# EAGLE schematic sub-unit-and-psu (EAGLE 9.6.2)
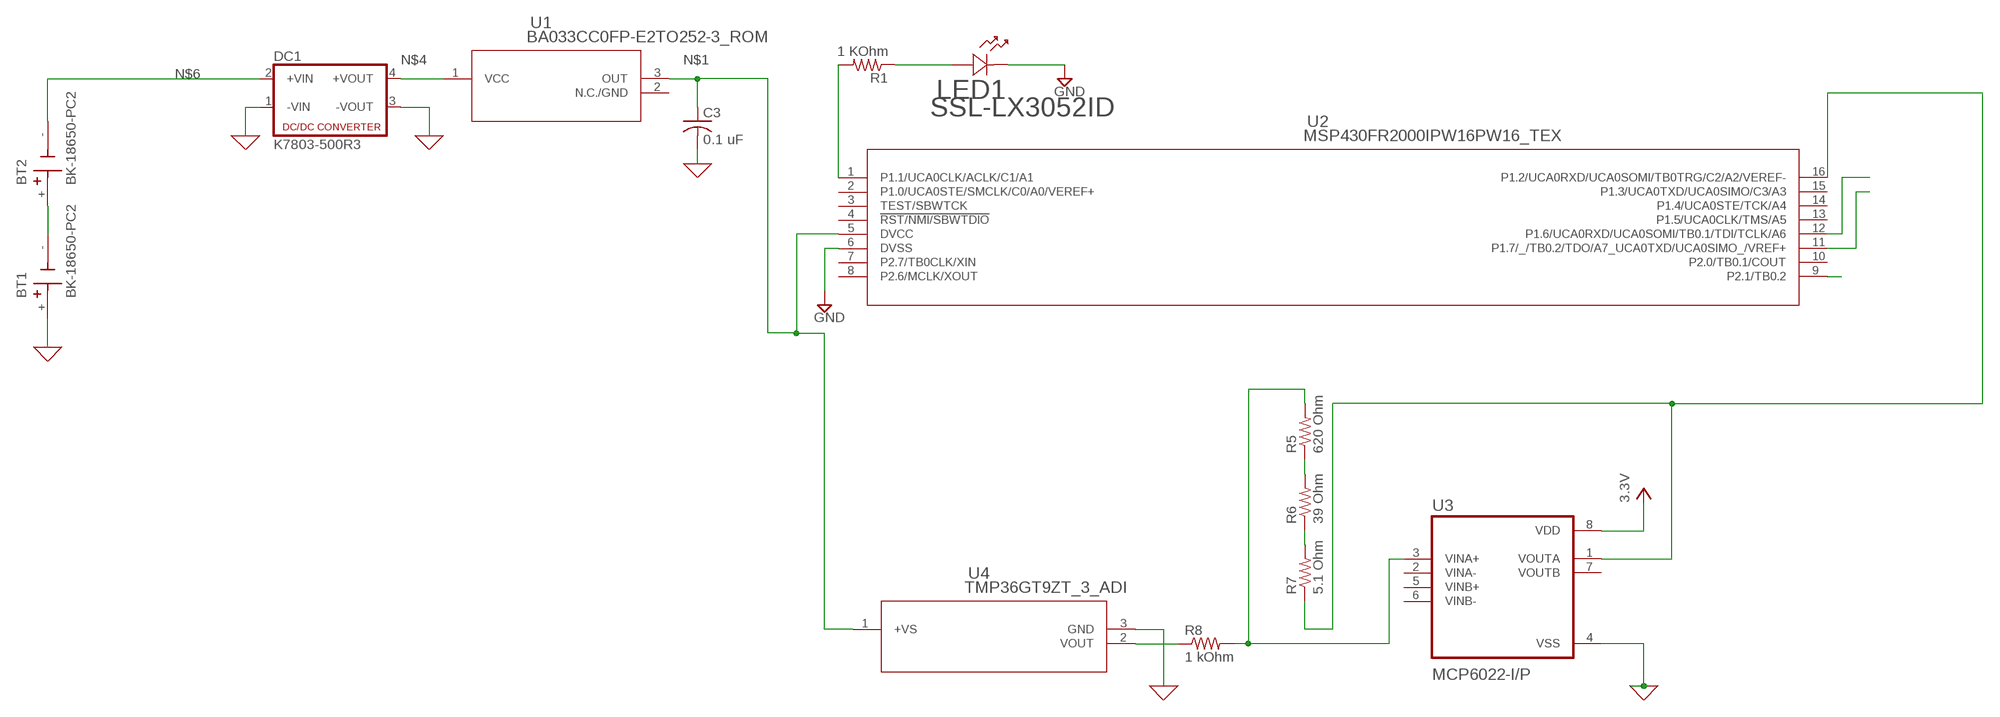
[diagram p0: schematic, sheet 1]

## Parts
BT1  BK-18650-PC2  [BAT_BK-18650-PC2]
BT2  BK-18650-PC2  [BAT_BK-18650-PC2]
C3  0.1 uF  C-US050-024X044  [C050-024X044]
DC1  K7803-500R3  NME  [NME]
LED1  SSL-LX3052ID  [LED_SSL-LX30_T-3_LUM]
R1  1 KOhm  R-US_0204/5  [0204/5]
R5  620 Ohm  R-US_0204/7  [0204/7]
R6  39 Ohm  R-US_0204/7  [0204/7]
R7  5.1 Ohm  R-US_0204/7  [0204/7]
R8  1 kOhm  R-US_0204/7  [0204/7]
U1  BA033CC0FP-E2TO252-3_ROM  [TO252-3_ROM]
U2  MSP430FR2000IPW16PW16_TEX  [PW16_TEX]
U3  MCP6022-I/P  [DIP787W46P254L927H533Q8]
U4  TMP36GT9ZT_3_ADI  [T_3_ADI]

## Nets
0: BT1.+ C3.2 DC1.1(-VIN) DC1.3(-VOUT) U3.4(VSS) U4.3(GND) ; supply symbol labelled GND
GND: LED1.1(ANODE) U2.6(DVSS)
N$1: C3.1 U1.3(OUT) U2.5(DVCC) U4.1(+VS)
N$2: BT1.- BT2.+
N$3: LED1.2 R1.1
N$4: DC1.4(+VOUT) U1.1(VCC)
N$5: U2.12(P1.6/UCA0RXD/UCA0SOMI/TB0.1/TDI/TCLK/A6)
N$6: BT2.- DC1.2(+VIN)
N$7: U2.11(P1.7/_/TB0.2/TDO/A7_UCA0TXD/UCA0SIMO_/VREF+)
N$8: R1.2 U2.1(P1.1/UCA0CLK/ACLK/C1/A1)
N$9: R8.1 U4.2(VOUT)
N$10: U2.9(P2.1/TB0.2)
N$13: R6.1 R7.2
N$14: R5.1 R6.2
N$15: R7.1 U2.16(P1.2/UCA0RXD/UCA0SOMI/TB0TRG/C2/A2/VEREF-) U3.1(VOUTA)
N$16: R5.2 R8.2 U3.3(VINA+)
VCC: U3.8(VDD) ; supply symbol labelled 3.3V
Unconnected: U1.2(N.C./GND) U2.2(P1.0/UCA0STE/SMCLK/C0/A0/VEREF+) U2.3(TEST/SBWTCK) U2.4(!RST/NMI/SBWTDIO) U2.7(P2.7/TB0CLK/XIN) U2.8(P2.6/MCLK/XOUT) U2.10(P2.0/TB0.1/COUT) U2.13(P1.5/UCA0CLK/TMS/A5) U2.14(P1.4/UCA0STE/TCK/A4) U2.15(P1.3/UCA0TXD/UCA0SIMO/C3/A3) U3.2(VINA-) U3.5(VINB+) U3.6(VINB-) U3.7(VOUTB)

## Library data of the parts
BT1 BT2 = BK-18650-PC2:BK-18650-PC2: Battery Holder (Open) 18650 1 Cell PC Pin Check availability <https://pricing.snapeda.com/parts/BK-18650-PC2/MPD%20%28Memory%20Protection%20Devices%29/view-part?ref=eda>; AVAILABILITY: In Stock; DESCRIPTION: Battery Holder (Open) 18650 1 Cell PC Pin; MF: MPD (Memory Protection Devices); MP: BK-18650-PC2; PACKAGE: None; PRICE: None; PURCHASE-URL: https://pricing.snapeda.com/search/part/BK-18650-PC2/?ref=eda
C3 = rcl:C-US: CAPACITOR, American symbol; SPICEPREFIX: C
DC1 = dc-dc-converter:NME: DC-DC CONVERTER; MF: C & D TECHNOLOGIES, INC; MPN: NME1205D; OC_FARNELL: 1021466; OC_NEWARK: 98B8198
LED1 = Lumex SSL-LX3052ID RED LED:SSL-LX3052ID; COPYRIGHT: Copyright (C) 2023 Ultra Librarian. All rights reserved.; MANUFACTURER_PART_NUMBER: SSL-LX3052ID; MFR_NAME: Lumex
R1 = adafruit:R-US_: RESISTOR, American symbol
R5-R8 = rcl:R-US_: RESISTOR, American symbol; SPICEPREFIX: R
U1 = 2023-03-08_12-17-23_Library:BA033CC0FP-E2; COPYRIGHT: Copyright (C) 2023 Ultra Librarian. All rights reserved.; DIGI-KEY_PART_NUMBER_1: BA033CC0FP-E2TR-ND; DIGI-KEY_PART_NUMBER_2: BA033CC0FP-E2CT-ND; DIGI-KEY_PART_NUMBER_3: BA033CC0FP-E2DKR-ND; MANUFACTURER_PART_NUMBER: BA033CC0FP-E2; MFR_NAME: ROHM Semiconductor
U2 = MSP430FR2000 Sub-Unit:MSP430FR2000IPW16; COPYRIGHT: Copyright (C) 2023 Ultra Librarian. All rights reserved.; MANUFACTURER_PART_NUMBER: MSP430FR2000IPW16; MFR_NAME: Texas Instruments
U3 = MCP6022-I_P:MCP6022-I/P
U4 = 2023-03-28_14-12-25_Library:TMP36GT9Z; COPYRIGHT: Copyright (C) 2023 Ultra Librarian. All rights reserved.; DIGI-KEY_PART_NUMBER_1: TMP36GT9Z-ND; DIGI-KEY_PART_NUMBER_2: 2156-TMP36GT9Z-ND; MANUFACTURER_PART_NUMBER: TMP36GT9Z; MFR_NAME: Analog Devices Inc